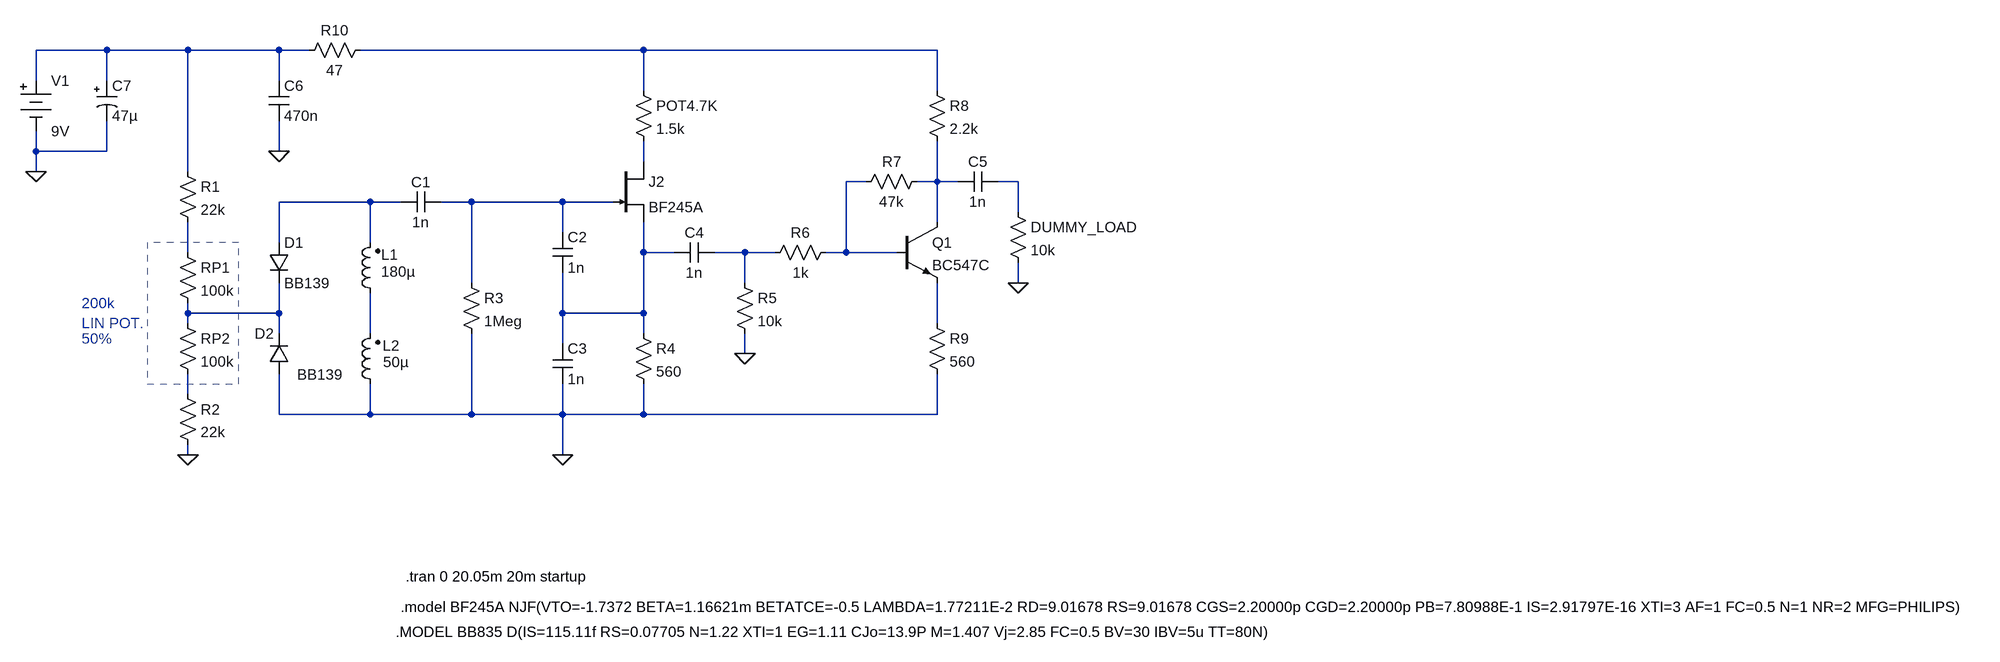
[diagram p0: schematic colpitts-oscillator-bfo.asc]
colpitts-oscillator-bfo.asc, the LTspice schematic file:
Version 4.1
SHEET 1 2704 760
WIRE -448 -176 -560 -176
WIRE -320 -176 -448 -176
WIRE -176 -176 -320 -176
WIRE -128 -176 -176 -176
WIRE 400 -176 -48 -176
WIRE 864 -176 400 -176
WIRE -560 -128 -560 -176
WIRE -448 -128 -448 -176
WIRE -176 -128 -176 -176
WIRE 400 -112 400 -176
WIRE 864 -112 864 -176
WIRE -560 -16 -560 -48
WIRE -448 -16 -448 -64
WIRE -448 -16 -560 -16
WIRE -176 -16 -176 -64
WIRE 400 0 400 -32
WIRE -560 16 -560 -16
WIRE -320 16 -320 -176
WIRE 752 32 720 32
WIRE 864 32 864 -32
WIRE 864 32 832 32
WIRE 896 32 864 32
WIRE 992 32 960 32
WIRE -32 64 -176 64
WIRE 16 64 -32 64
WIRE 128 64 80 64
WIRE 272 64 128 64
WIRE 352 64 272 64
WIRE 992 80 992 32
WIRE 864 96 864 32
WIRE 272 112 272 64
WIRE -176 128 -176 64
WIRE -32 128 -32 64
WIRE -320 144 -320 96
WIRE 400 144 400 96
WIRE 448 144 400 144
WIRE 560 144 512 144
WIRE 608 144 560 144
WIRE 720 144 720 32
WIRE 720 144 688 144
WIRE 800 144 720 144
WIRE 128 192 128 64
WIRE 560 192 560 144
WIRE 992 192 992 160
WIRE -320 240 -320 224
WIRE -176 240 -176 192
WIRE -176 240 -320 240
WIRE 272 240 272 176
WIRE 400 240 400 144
WIRE 400 240 272 240
WIRE -320 256 -320 240
WIRE 864 256 864 192
WIRE -176 272 -176 240
WIRE -32 272 -32 208
WIRE 400 272 400 240
WIRE 272 288 272 240
WIRE 560 304 560 272
WIRE -320 368 -320 336
WIRE -176 400 -176 336
WIRE -32 400 -32 352
WIRE -32 400 -176 400
WIRE 128 400 128 272
WIRE 128 400 -32 400
WIRE 272 400 272 352
WIRE 272 400 128 400
WIRE 400 400 400 352
WIRE 400 400 272 400
WIRE 864 400 864 336
WIRE 864 400 400 400
WIRE -320 464 -320 448
WIRE 272 464 272 400
FLAG 272 464 0
FLAG -560 16 0
FLAG -320 464 0
FLAG 560 304 0
FLAG 992 192 0
FLAG -176 -16 0
SYMBOL cap 256 112 R0
SYMATTR InstName C2
SYMATTR Value 1n
SYMBOL cap 256 288 R0
SYMATTR InstName C3
SYMATTR Value 1n
SYMBOL res 384 256 R0
SYMATTR InstName R4
SYMATTR Value 560
SYMBOL Misc\\battery -560 -144 R0
SYMATTR InstName V1
SYMATTR Value 9V
SYMBOL ind2 -16 224 R180
WINDOW 0 -28 77 Left 2
WINDOW 3 -55 50 Left 2
SYMATTR InstName L1
SYMATTR Value 180µ
SYMATTR SpiceLine Rser=9
SYMBOL ind2 -16 368 R180
WINDOW 0 -31 77 Left 2
WINDOW 3 -45 51 Left 2
SYMATTR InstName L2
SYMATTR Value 50µ
SYMATTR SpiceLine Rser=9
SYMBOL njf 352 0 R0
SYMATTR InstName J2
SYMATTR Value BF245A
SYMBOL res 112 176 R0
SYMATTR InstName R3
SYMATTR Value 1Meg
SYMBOL res 384 -128 R0
SYMATTR InstName POT4.7K
SYMATTR Value 1.5k
SYMBOL cap 16 80 R270
WINDOW 0 32 32 VTop 2
WINDOW 3 0 32 VBottom 2
SYMATTR InstName C1
SYMATTR Value 1n
SYMBOL res -336 352 R0
SYMATTR InstName R2
SYMATTR Value 22k
SYMBOL res -336 0 R0
SYMATTR InstName R1
SYMATTR Value 22k
SYMBOL res -336 240 R0
SYMATTR InstName RP2
SYMATTR Value 100k
SYMBOL res -336 128 R0
SYMATTR InstName RP1
SYMATTR Value 100k
SYMBOL cap 448 160 R270
WINDOW 0 32 32 VTop 2
WINDOW 3 0 32 VBottom 2
SYMATTR InstName C4
SYMATTR Value 1n
SYMBOL res 544 176 R0
SYMATTR InstName R5
SYMATTR Value 10k
SYMBOL diode -192 128 R0
SYMATTR InstName D1
SYMATTR Value BB139
SYMBOL diode -160 336 R180
WINDOW 0 24 64 Left 2
WINDOW 3 -85 -1 Left 2
SYMATTR InstName D2
SYMATTR Value BB139
SYMBOL npn 800 96 R0
SYMATTR InstName Q1
SYMATTR Value BC547C
SYMBOL res 704 128 R90
WINDOW 0 0 56 VBottom 2
WINDOW 3 32 56 VTop 2
SYMATTR InstName R6
SYMATTR Value 1k
SYMBOL res 848 240 R0
SYMATTR InstName R9
SYMATTR Value 560
SYMBOL res 848 -128 R0
SYMATTR InstName R8
SYMATTR Value 2.2k
SYMBOL res 736 48 R270
WINDOW 0 32 56 VTop 2
WINDOW 3 0 56 VBottom 2
SYMATTR InstName R7
SYMATTR Value 47k
SYMBOL cap 896 48 R270
WINDOW 0 32 32 VTop 2
WINDOW 3 0 32 VBottom 2
SYMATTR InstName C5
SYMATTR Value 1n
SYMBOL res 976 64 R0
SYMATTR InstName DUMMY_LOAD
SYMATTR Value 10k
SYMBOL cap -192 -128 R0
SYMATTR InstName C6
SYMATTR Value 470n
SYMBOL res -144 -160 R270
WINDOW 0 32 56 VTop 2
WINDOW 3 0 56 VBottom 2
SYMATTR InstName R10
SYMATTR Value 47
SYMBOL polcap -464 -128 R0
SYMATTR InstName C7
SYMATTR Value 47µ
TEXT 24 656 Left 2 !.tran 0 20.05m 20m startup
TEXT 16 704 Left 2 !.model BF245A NJF(VTO=-1.7372 BETA=1.16621m BETATCE=-0.5 LAMBDA=1.77211E-2 RD=9.01678 RS=9.01678 CGS=2.20000p CGD=2.20000p PB=7.80988E-1 IS=2.91797E-16 XTI=3 AF=1 FC=0.5 N=1 NR=2 MFG=PHILIPS)
TEXT -488 224 Left 2 ;200k\nLIN POT.
TEXT 8 744 Left 2 !.MODEL BB835 D(IS=115.11f RS=0.07705 N=1.22 XTI=1 EG=1.11 CJo=13.9P M=1.407 Vj=2.85 FC=0.5 BV=30 IBV=5u TT=80N)
TEXT -488 280 Left 2 ;50%
RECTANGLE Normal -240 128 -384 352 2

The netlist it stands for:
* colpitts-oscillator-bfo.asc
C2 N008 N010 1n
C3 N010 0 1n
R4 N010 0 560
V1 N001 0 9V
L1 N014 N007 180µ Rser=9
L2 0 N014 50µ Rser=9
J2 N003 N008 N010 BF245A
R3 N008 0 1Meg
R§POT4.7K N002 N003 1.5k
C1 N007 N008 1n
R2 N015 0 22k
R1 N001 N009 22k
RP2 N012 N015 100k
RP1 N009 N012 100k
C4 N010 N011 1n
R5 N011 0 10k
D1 N007 N012 BB139
D2 0 N012 BB139
Q1 N005 N004 N013 0 BC547C
R6 N004 N011 1k
R9 N013 0 560
R8 N002 N005 2.2k
R7 N004 N005 47k
C5 N005 N006 1n
R§DUMMY_LOAD N006 0 10k
C6 N001 0 470n
R10 N001 N002 47
C7 N001 0 47µ
.model D D
.lib standard.dio
.model NPN NPN
.model PNP PNP
.lib standard.bjt
.model NJF NJF
.model PJF PJF
.lib standard.jft
.tran 0 20.05m 20m startup
.model BF245A NJF(VTO=-1.7372 BETA=1.16621m BETATCE=-0.5 LAMBDA=1.77211E-2 RD=9.01678 RS=9.01678 CGS=2.20000p CGD=2.20000p PB=7.80988E-1 IS=2.91797E-16 XTI=3 AF=1 FC=0.5 N=1 NR=2 MFG=PHILIPS)
* 200k
* LIN POT.
.MODEL BB835 D(IS=115.11f RS=0.07705 N=1.22 XTI=1 EG=1.11 CJo=13.9P M=1.407 Vj=2.85 FC=0.5 BV=30 IBV=5u TT=80N)
* 50%
.backanno
.end